# Altium schematic sheet KHOI_NGUON.SchDoc
size B; SheetNumber: 1; SheetTotal: 2
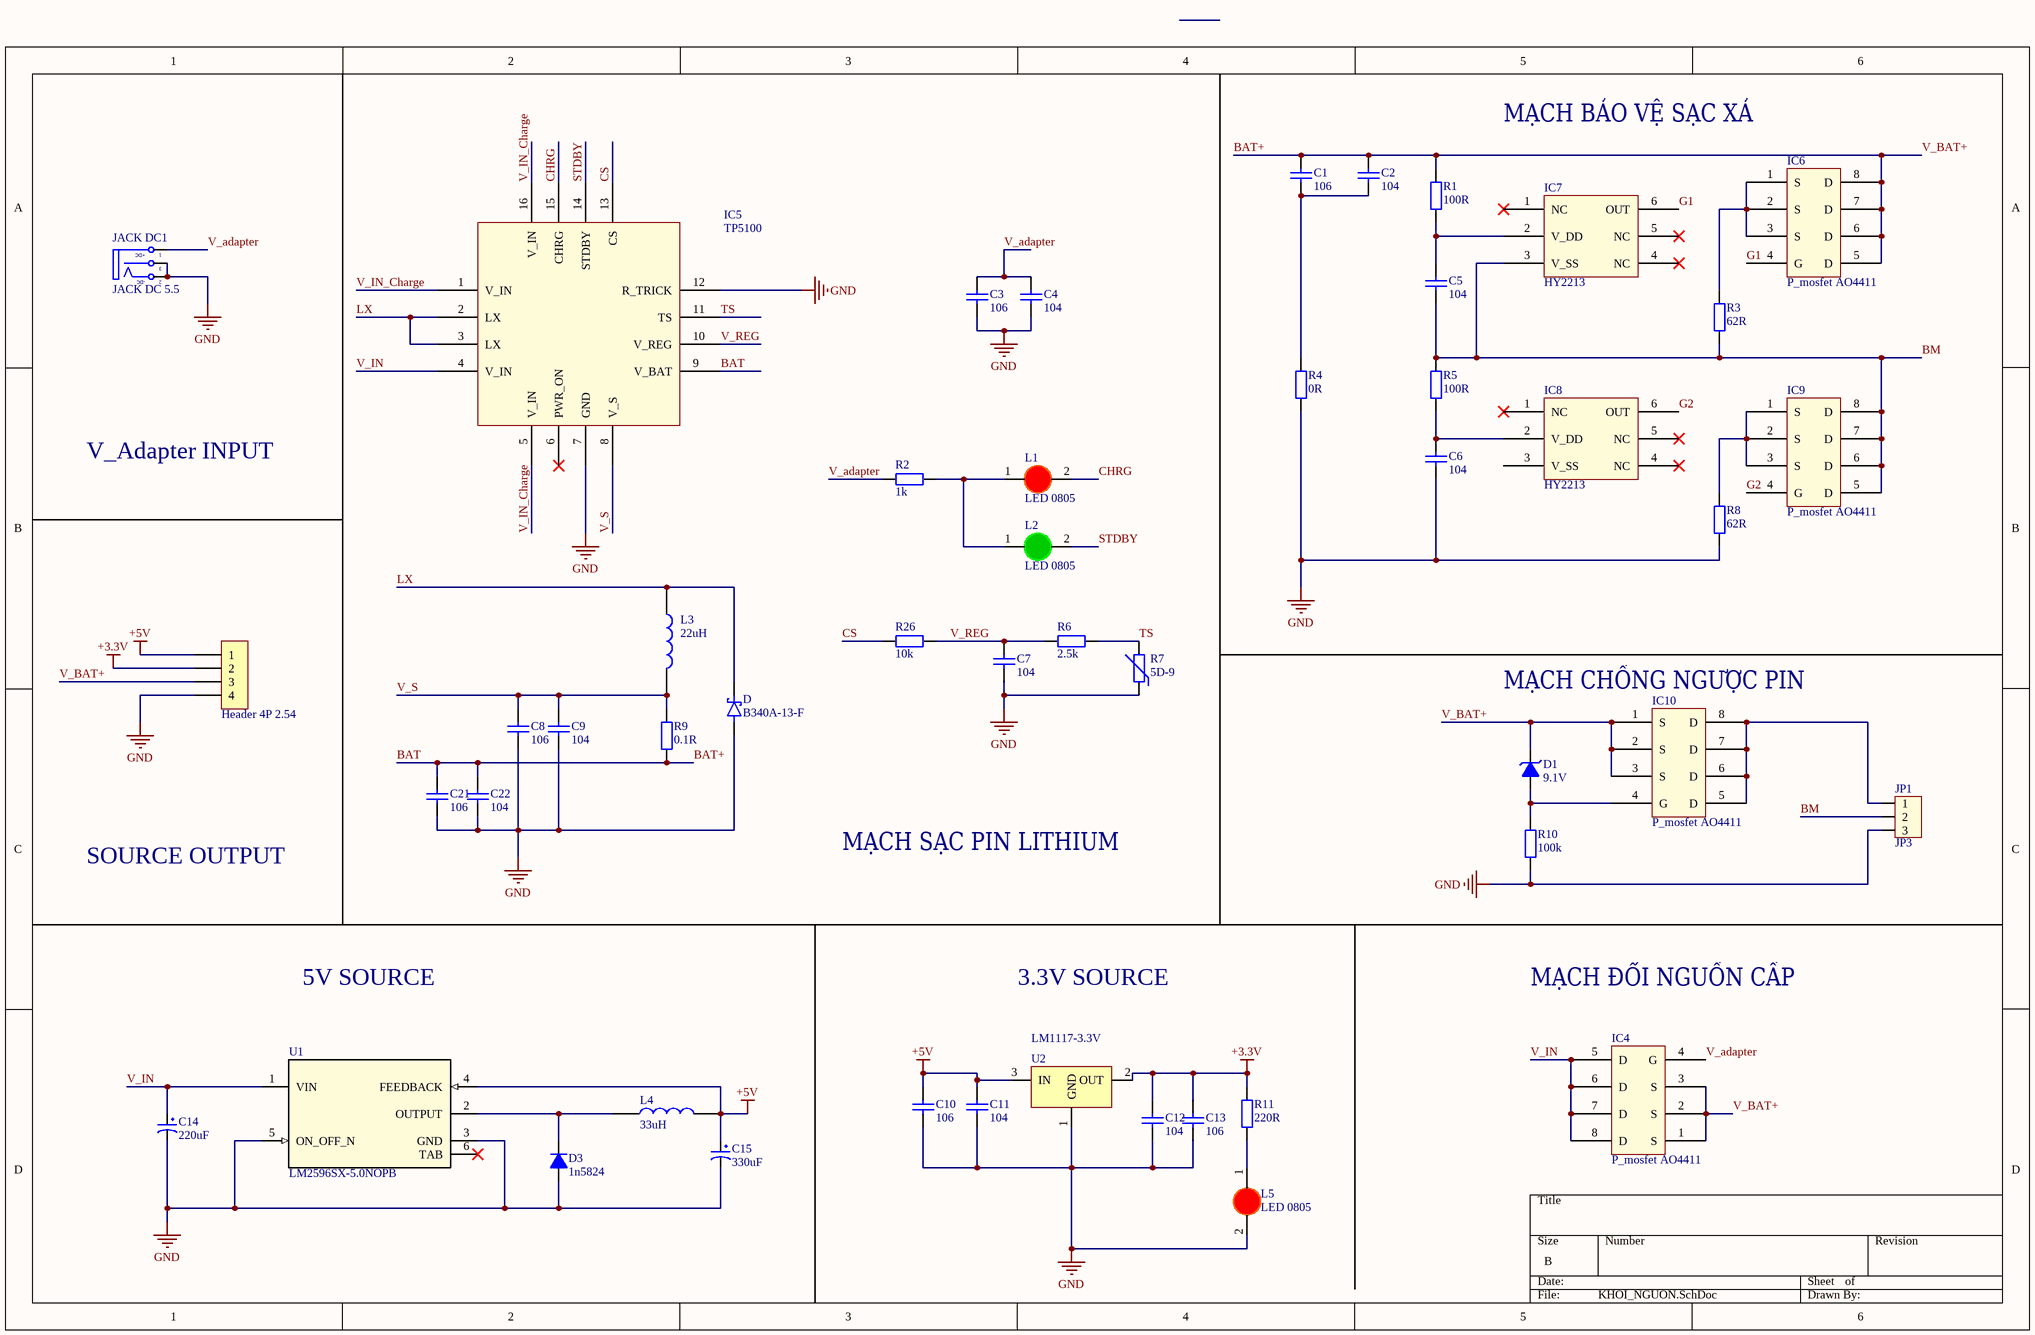
[diagram p0: KHOI_NGUON.SchDoc]

## Parts
C1  106  [tu 1206]
C2  104  [tu 1206]
C3  106  [tu 1206]
C4  104  [tu 1206]
C5  104  [tu 1206]
C6  104  [tu 1206]
C7  104  [tu 1206]
C8  106  [tu 1206]
C9  104  [tu 1206]
C10  106  [tu 1206]
C11  104  [tu 1206]
C12  104  [tu 1206]
C13  106  [tu 1206]
C14  220uF  [tu hoa 6.5mm]
C15  330uF  [tu hoa 10mm]
C21  106  [tu 1206]
C22  104  [tu 1206]
D  B340A-13-F  [DIOM5226X240N]
D1  9.1V  [DIODE ZENNER SMD SOD80]
D3  1n5824  [DIODE 1A]
H1  Header 4P 2.54  [XH2.54M-4]
IC4  P_mosfet AO4411  [SOIC8_AO4411]
IC5  TP5100  [QFN_16_4*4]
IC6  P_mosfet AO4411  [SOIC8_AO4411]
IC7  HY2213  [SOT_23_6_HY2213]
IC8  HY2213  [SOT_23_6_HY2213]
IC9  P_mosfet AO4411  [SOIC8_AO4411]
IC10  P_mosfet AO4411  [SOIC8_AO4411]
JACK_DC1  JACK DC 5.5  [JACK DC 5.5]
JP1  JP3  [CON3]
L1  LED 0805  [LED-1206-Red]
L2  LED 0805  [LED-1206-Green]
L3  22uH  [Cuon Cam 12x12x10]
L4  33uH  [Cuon Cam 12x12x10]
L5  LED 0805  [LED-0805-Red]
R1  100R  [tro smd 0805]
R2  1k  [tro smd 0805]
R3  62R  [tro smd 0805]
R4  0R  [tro smd 0805]
R5  100R  [tro smd 0805]
R6  2.5k  [tro smd 0805]
R7  5D-9  [tro nhiet d-9]
R8  62R  [tro smd 0805]
R9  0.1R  [tro smd 2512]
R10  100k  [tro smd 0805]
R11  220R  [tro smd 0805]
R26  10k  [tro smd 0805]
U1  LM2596SX-5.0NOPB  [KTT0005B]
U2  LM1117-3.3V  [LM1117-SOP]

## Nets
+3.3V: C12.1 C13.2 H1.2 R11.1 U2.2(OUT)
+5V: C10.2 C11.1 C15.1 H1.1 L4.2 U1.4(FEEDBACK) U2.3(IN)
GND: C3.1 C4.2 C6.2 C7.2 C8.1 C9.2 C10.1 C11.2 C12.2 C13.1 C14.2 C15.2 C21.1 C22.2 D.A D3.1(A) H1.4 IC5.7(GND) IC5.12(R_TRICK) JACK_DC1.2(TN) JACK_DC1.3(S) JP1.3 L5.2(K) R4.1 R7.1 R8.1 R10.1 U1.3(GND) U1.5(ON_OFF_N) U2.1(GND)
BAT: C1.2 C2.1 C21.2 C22.1 D1.2(K) H1.3 IC4.1(S) IC4.2(S) IC4.3(S) IC5.9(V_BAT) IC6.5(D) IC6.6(D) IC6.7(D) IC6.8(D) IC10.1(S) IC10.2(S) IC10.3(S) R1.2 R9.1  [also labelled BAT+, V_BAT+]
BM: C5.2 IC7.3(V_SS) IC9.5(D) IC9.6(D) IC9.7(D) IC9.8(D) JP1.2 R3.1 R5.2
CHRG: IC5.15(CHRG) L1.2(K)
CS: IC5.13(CS) R26.2
G1: IC6.4(G) IC7.6(OUT)
G2: IC8.6(OUT) IC9.4(G)
LX: D.C IC5.2(LX) IC5.3(LX) L3.1
STDBY: IC5.14(STDBY) L2.2(K)
TS: IC5.11(TS) R6.2 R7.2
V_adapter: C3.2 C4.1 IC4.4(G) JACK_DC1.1(T) R2.2
V_IN: C14.1 IC4.5(D) IC4.6(D) IC4.7(D) IC4.8(D) IC5.4(V_IN) U1.1(VIN)
V_IN_Charge: IC5.1(V_IN) IC5.5(V_IN) IC5.16(V_IN)
V_REG: C7.1 IC5.10(V_REG) R6.1 R26.1
V_S: C8.2 C9.1 IC5.8(V_S) L3.2 R9.2
NetC1_1: C1.1 C2.2 R4.2
NetC5_1: C5.1 IC7.2(V_DD) R1.1
NetC6_1: C6.1 IC8.2(V_DD) R5.1
NetD1_1: D1.1(A) IC10.4(G) R10.2
NetD3_2: D3.2(K) L4.1 U1.2(OUTPUT)
NetIC6_1: IC6.1(S) IC6.2(S) IC6.3(S) R3.2
NetIC9_1: IC9.1(S) IC9.2(S) IC9.3(S) R8.2
NetIC10_5: IC10.5(D) IC10.6(D) IC10.7(D) IC10.8(D) JP1.1
NetL1_1: L1.1(A) L2.1(A) R2.1
NetL5_1: L5.1(A) R11.2

Not connected (* = marked no-connect by the designer): IC5 6(PWR_ON)*; IC7 1(NC)* 4(NC)* 5(NC)*; IC8 1(NC)* 3(V_SS) 4(NC)* 5(NC)*; U1 6(TAB)*

## Notes on the sheet
- MẠCH BẢO VỆ SẠC XẢ
- V_Adapter INPUT
- (near IC10) MẠCH CHỐNG NGƯỢC PIN
- SOURCE OUTPUT
- MẠCH SẠC PIN LITHIUM
- 5V SOURCE
- 3.3V SOURCE
- MẠCH ĐỔI NGUỒN CẤP
- (in symbol JACK DC 5.5) +DC; -DC

## Library data of the parts
C1 C3 C8 C10 C13 C21 = Tu 1206 106 16V 20%: Dán; Don_Vi: Con; So_Chan: 2; Ten_Linh_Kien: Tụ 1206 106-10uF 20% 16V; Ma_Hang: MH004541; Chung_Loai: Dán; Kieu_Chan: *
C2 C4-C7 C9 C11 C12 C22 = Tu 1206 104 50V 20%: Dán; Don_Vi: Con; So_Chan: 2; Ten_Linh_Kien: Tụ 1206 104-0.1uF 20% 50V; Ma_Hang: MH004544; Chung_Loai: Dán; Kieu_Chan: *
C14 = Tu Hoa 220uF 16V 7x11: Cắm; Don_Vi: Con; Ten_Linh_Kien: Tụ Hóa 220uF 16V 7x11MM; So_Chan: 2; Ma_Hang: MH008416; Chung_Loai: Cắm; Kieu_Chan: *
C15 = Tu Hoa 330uF 35V 10x12: Cắm; So_Chan: 2; Don_Vi: Con; Ten_Linh_Kien: Tụ Hóa 330uF 35V 10x12MM; Ma_Hang: MH004802; Chung_Loai: Cắm; Kieu_Chan: *
D = B340A-13-F: Diode Schottky 40V 3A Surface Mount SMA; MF: Diodes Inc.; Availability: Unavailable; MP: B340A-13-F; Price: None; Value: *; SnapEDA_Link: https://www.snapeda.com/parts/B340A-13-F/Diodes%20Inc./view-part/78704/?ref=snap; Package: DO-214 Diodes Inc.
D1 = Diode Zener 9.1V: Dán; Don_Vi: Con; Ma_Hang: MH002882; Ten_Linh_Kien: Diode Zener 1/2W 9.1V SMD1206 ZMM9.1; Ghi_Chu: *; Chung_Loai: Dán; Kieu_Chan: *
D3 = Diode 1N4007: Cắm; Ten_Linh_Kien: Diode 1N4007 1A (DIP); Don_Vi: Con; Ma_Hang: MH001063; Ghi Chu: *; Kieu_Chan: *; Chung_Loai: Cắm
H1 = Header 4P 2.54 Duc Thang: Cắm; Ten_Linh_Kien: Header 4P XH2.54-4P Đực Thẳng; Don_Vi: Con; Ma_Hang: MH001285; Chung_Loai: Cắm
IC5 = TP5100: IC sạc pin Lithium
JACK_DC1 = JACK DC 5.5: Value: Jac DC
JP1 = Con3: Connector 3; Value: Connector 3
L1 = LED 1206 Do: Dán; Don_Vi: Con; Ma_Hang: MH002334; Ten_Linh_Kien: LED1206 Màu Đỏ (Red); Ghi_Chu: *; Kieu_Chan: *; Chung_Loai: Dán
L2 = LED 1206 Xanh La: Dán; Don_Vi: Con; Ma_Hang: MH002947; Ten_Linh_Kien: LED1206 Màu Xanh Lá (Green); Ghi_Chu: *; Kieu_Chan: *; Chung_Loai: Dán
L3 L4 = CUON CAM 100uH SMD: Dán; Don_Vi: Con; Ma_Hang: MH003999; Ten_Linh_Kien: Cuộn Cảm 100uH 7x7x4MM CD74; Ma_Hang: *; Kieu_Chan: *; Chung_Loai: Dán
L5 = LED 0805 Do: Dán; Don_Vi: Con; Ma_Hang: MH000897; Ten_Linh_Kien: LED 0805 Màu Đỏ (Red); Ghi_Chu: *; Kieu_Chan: *; Chung_Loai: Dán
R1 R5 = Tro 0805 1% 10R: Dán; Don_Vi: Con; So_Chan: 2; Ten_Linh_Kien: Trở 0805 1% 10R; Ma_Hang: MH005474; Chung_Loai: Dán; Kieu_Chan: *
R2 R26 = Tro 0805 1% 1k: Dán; Don_Vi: Con; So_Chan: 2; Ten_Linh_Kien: Trở 0805 1% 1k; Ma_Hang: MH005468; Chung_Loai: Dán; Kieu_Chan: *
R3 R8 = Tro 0805 5% 62R: Dán; Don_Vi: Con; So_Chan: 2; Ten_Linh_Kien: Trở 0805 5% 62R; Ma_Hang: MH005324; Chung_Loai: Dán; Kieu_Chan: *
R4 = Tro 0805 5% 0R: Dán; Don_Vi: Con; So_Chan: 2; Ten_Linh_Kien: Trở 0805 5% 0R; Ma_Hang: MH005230; Chung_Loai: Dán; Kieu_Chan: *
R6 = Tro 0805 5% 2.7k: Dán; Don_Vi: Con; So_Chan: 2; Ten_Linh_Kien: Trở 0805 5% 2.7k; Ma_Hang: MH005238; Chung_Loai: Dán; Kieu_Chan: *
R7 = Tro Nhiet NTC 5D-9: Cắm; So_Chan: 2; Don_Vi: Con; Ten_Linh_Kien: Điện Trở Nhiệt NTC 5D-9; Ma_Hang: MH005857; Chung_Loai: Cắm; Kieu_Chan: *
R9 = Tro 2512 5% 0.1R: Dán; Don_Vi: Con; So_Chan: 2; Ten_Linh_Kien: Trở 2512 5% 0.1R 1W; Ma_Hang: MH004711; Chung_Loai: Dán; Kieu_Chan: *
R10 = Tro 0805 5% 100k: Dán; Don_Vi: Con; So_Chan: 2; Ten_Linh_Kien: Trở 0805 5% 100k; Ma_Hang: MH005250; Chung_Loai: Dán; Kieu_Chan: *
R11 = Tro 0805 1% 0.5R: Dán; Don_Vi: Con; So_Chan: 2; Ten_Linh_Kien: Trở 0805 1% 0.5R; Ma_Hang: MH005465; Chung_Loai: Dán; Kieu_Chan: *
U1 = LM2596SX-5.0NOPB: No Description Available; Mfr_Name: Texas Instruments; PartNumber: LM2596SX-ADJ/NOPB; Alternate_PartNumber: LM2596S-ADJ/NOPB; CompType: IC; TYPE: TYPE; RefDes: RefDes; PackageReference: KTT0005B; MountType: SMT; RoHS: Y; Manufacturer: Texas Instruments
U2 = LM1117: 800mA Low-Dropout Linear Regulator; Creator: Nguyen Ba Bien; Website: http://group3i.net